# EAGLE schematic csa_blitter-v2.1a (EAGLE 4.15)
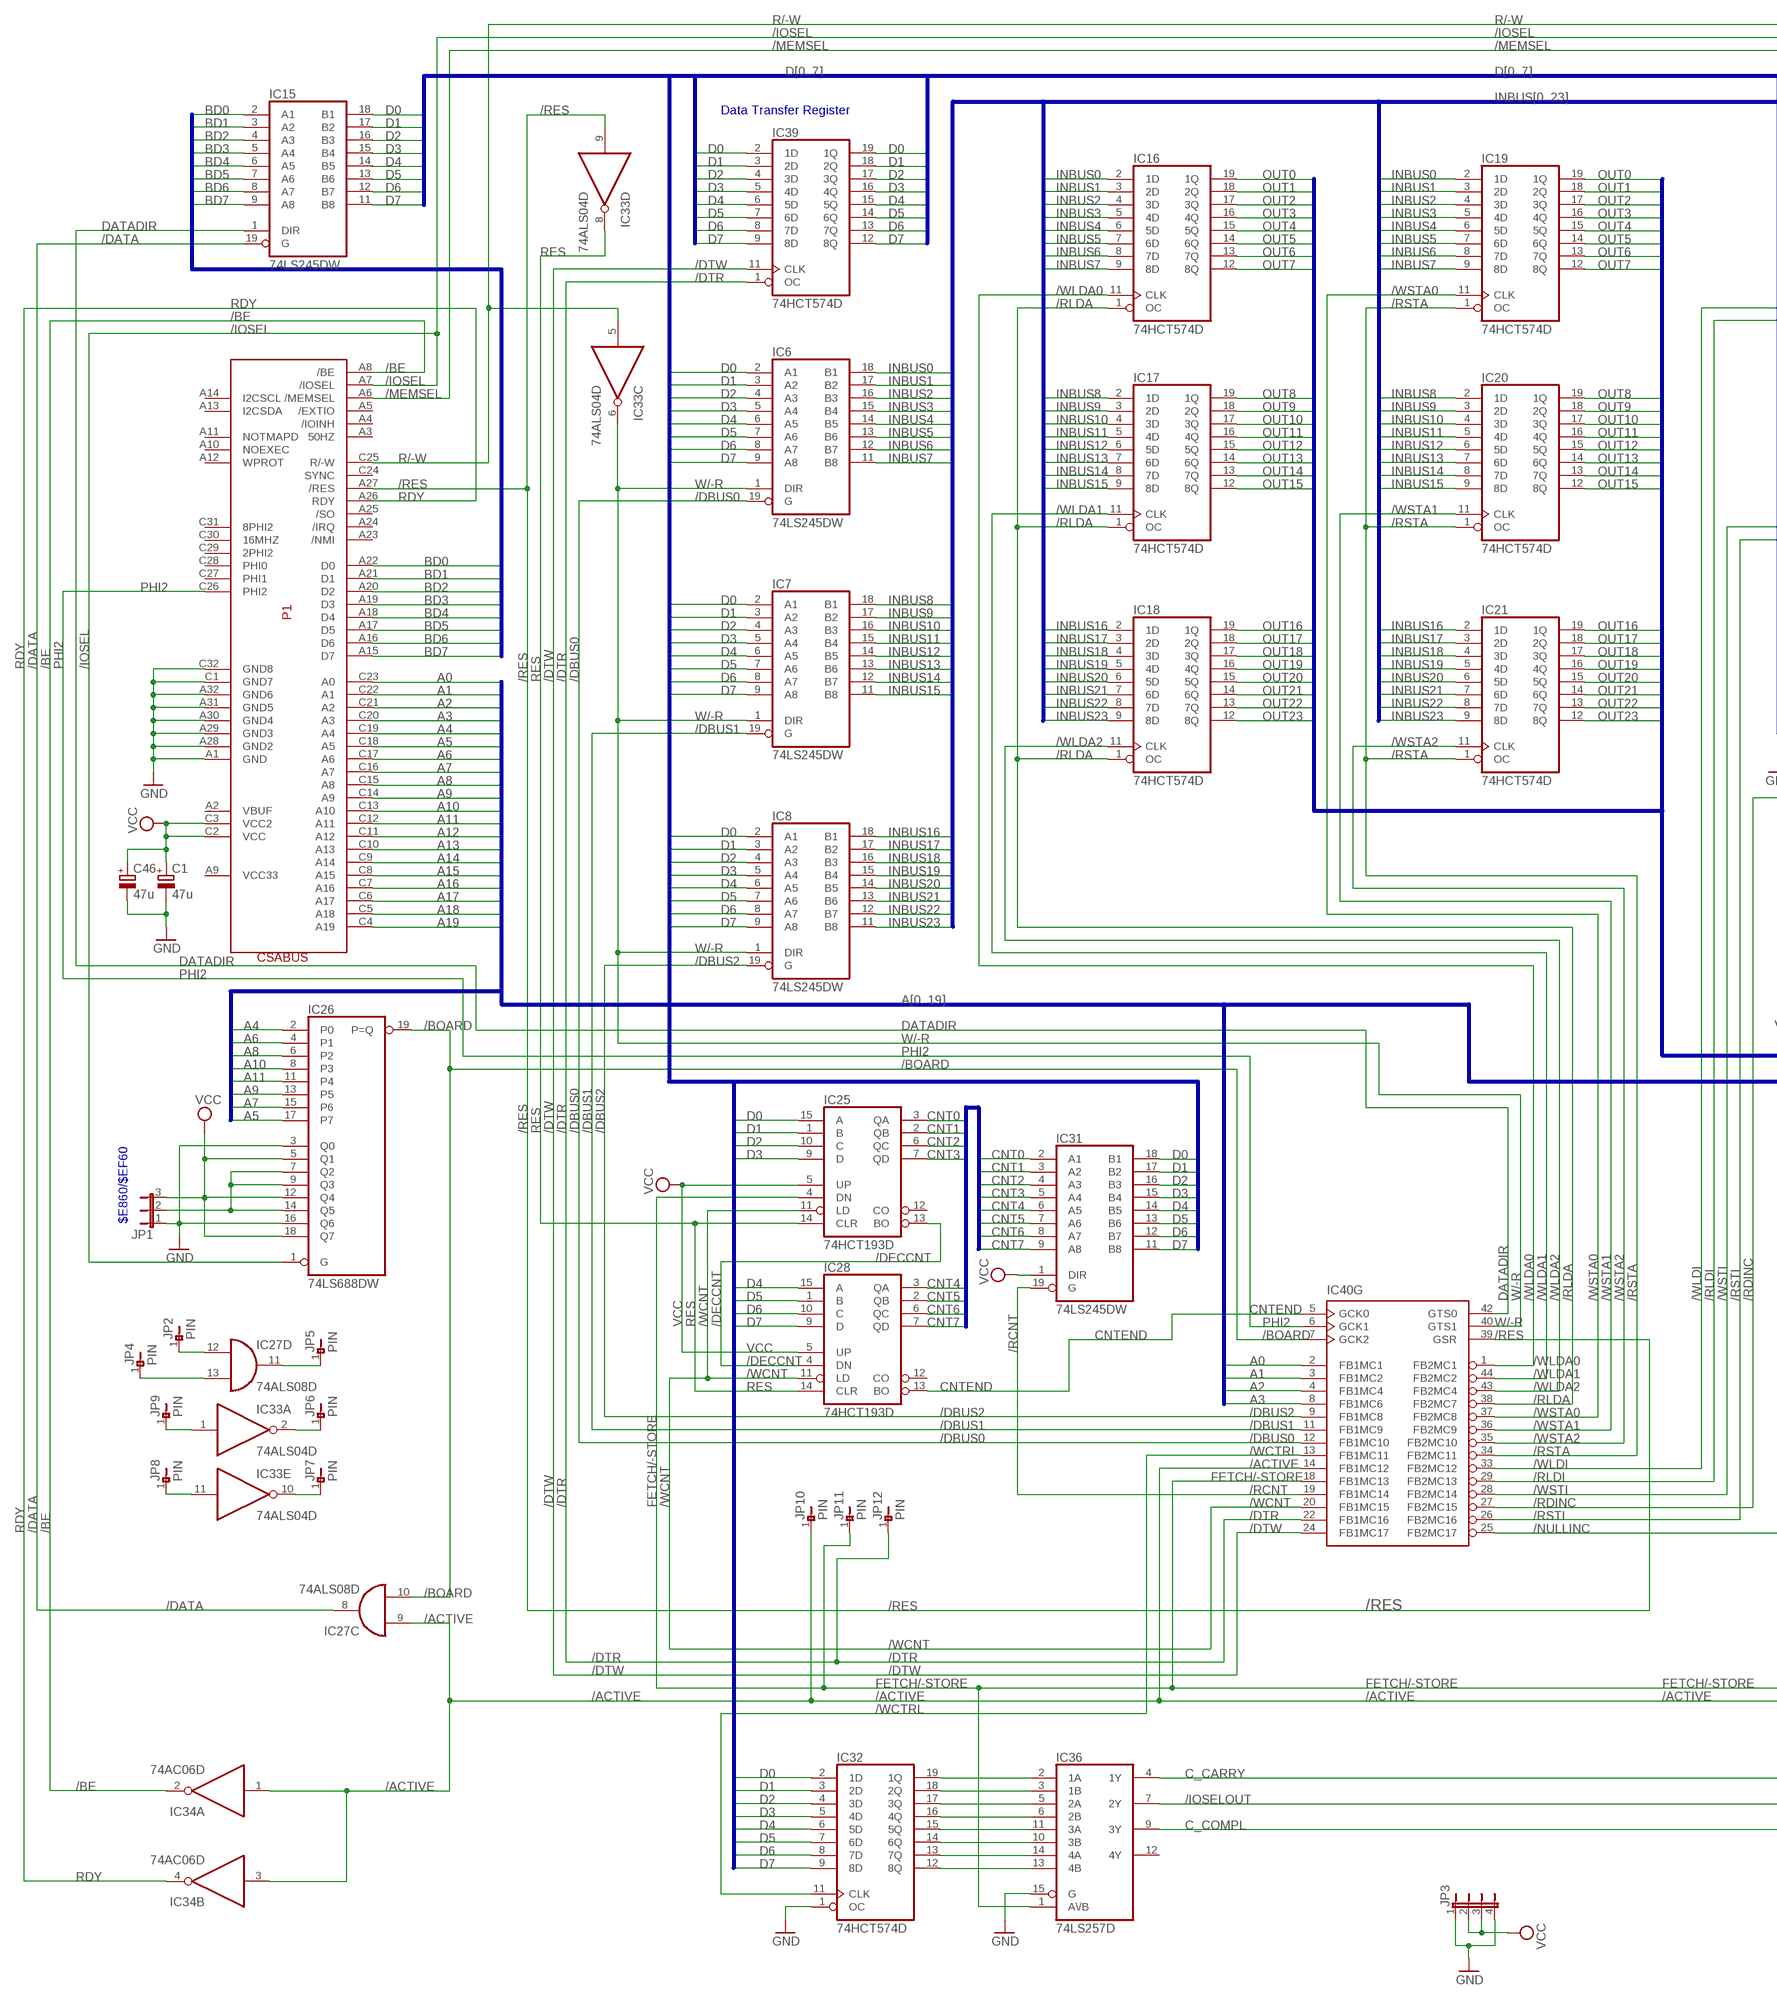
[diagram p0: schematic, sheet 1, part 1 of 2]
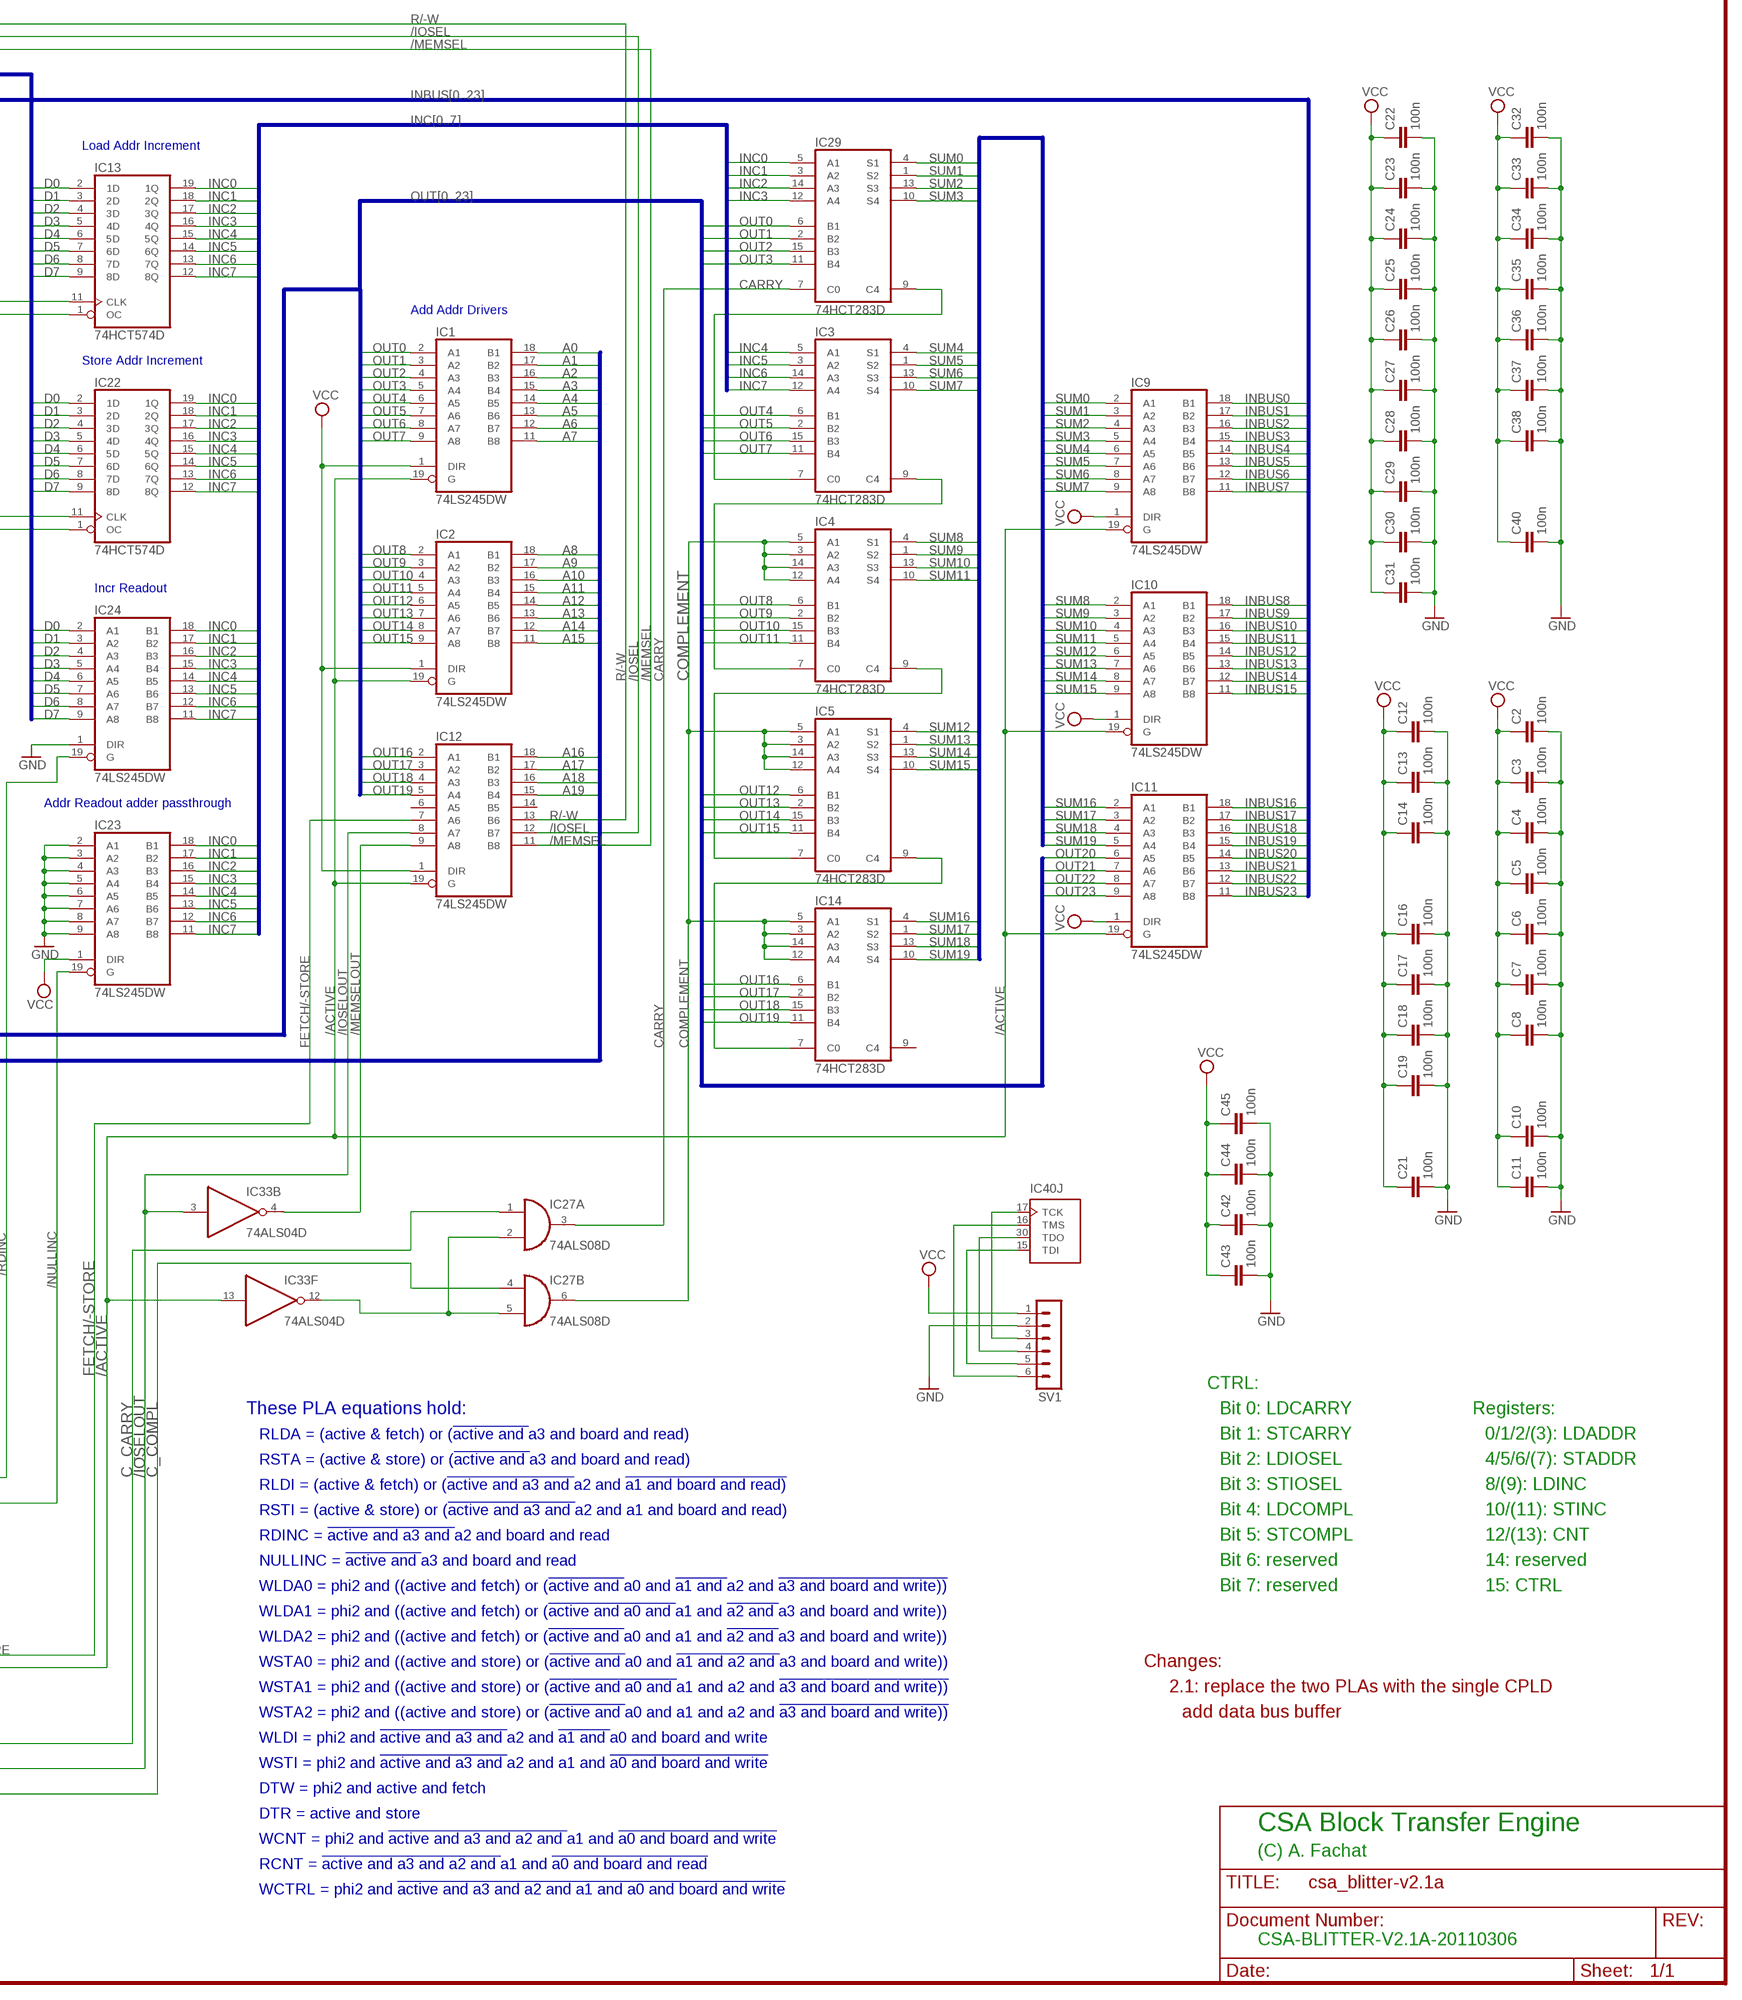
[diagram p1: schematic, sheet 1, part 2 of 2]

## Parts
C1  47u  CPOL-EUE2.5-7  [E2,5-7]
C2  100n  C-EUC1206  [C1206]
C3  100n  C-EUC1206  [C1206]
C4  100n  C-EUC1206  [C1206]
C5  100n  C-EUC1206  [C1206]
C6  100n  C-EUC1206  [C1206]
C7  100n  C-EUC1206  [C1206]
C8  100n  C-EUC1206  [C1206]
C10  100n  C-EUC1206  [C1206]
C11  100n  C-EUC1206  [C1206]
C12  100n  C-EUC1206  [C1206]
C13  100n  C-EUC1206  [C1206]
C14  100n  C-EUC1206  [C1206]
C16  100n  C-EU025-025X050  [C025-025X050]
C17  100n  C-EUC1206  [C1206]
C18  100n  C-EUC1206  [C1206]
C19  100n  C-EUC1206  [C1206]
C21  100n  C-EUC1206  [C1206]
C22  100n  C-EUC1206  [C1206]
C23  100n  C-EUC1206  [C1206]
C24  100n  C-EUC1206  [C1206]
C25  100n  C-EUC1206  [C1206]
C26  100n  C-EUC1206  [C1206]
C27  100n  C-EUC1206  [C1206]
C28  100n  C-EUC1206  [C1206]
C29  100n  C-EUC1206  [C1206]
C30  100n  C-EUC1206  [C1206]
C31  100n  C-EUC1206  [C1206]
C32  100n  C-EUC1206  [C1206]
C33  100n  C-EUC1206  [C1206]
C34  100n  C-EUC1206  [C1206]
C35  100n  C-EU025-025X050  [C025-025X050]
C36  100n  C-EU025-025X050  [C025-025X050]
C37  100n  C-EUC1206  [C1206]
C38  100n  C-EUC1206  [C1206]
C40  100n  C-EUC1206  [C1206]
C42  100n  C-EUC1206  [C1206]
C43  100n  C-EUC1206  [C1206]
C44  100n  C-EU025-025X050  [C025-025X050]
C45  100n  C-EUC1206  [C1206]
C46  47u  CPOL-EUE2.5-7  [E2,5-7]
IC1  74LS245DW  [SO20W]
IC2  74LS245DW  [SO20W]
IC3  74HCT283D  [SO16]
IC4  74HCT283D  [SO16]
IC5  74HCT283D  [SO16]
IC6  74LS245DW  [SO20W]
IC7  74LS245DW  [SO20W]
IC8  74LS245DW  [SO20W]
IC9  74LS245DW  [SO20W]
IC10  74LS245DW  [SO20W]
IC11  74LS245DW  [SO20W]
IC12  74LS245DW  [SO20W]
IC13  74HCT574D  [SO20W]
IC14  74HCT283D  [SO16]
IC15  74LS245DW  [SO20W]
IC16  74HCT574D  [SO20W]
IC17  74HCT574D  [SO20W]
IC18  74HCT574D  [SO20W]
IC19  74HCT574D  [SO20W]
IC20  74HCT574D  [SO20W]
IC21  74HCT574D  [SO20W]
IC22  74HCT574D  [SO20W]
IC23  74LS245DW  [SO20W]
IC24  74LS245DW  [SO20W]
IC25  74HCT193D  74HCT192D  [SO16]
IC26  74LS688DW  [SO20W]
IC27  74ALS08D  [SO14]
IC28  74HCT193D  74HCT192D  [SO16]
IC29  74HCT283D  [SO16]
IC31  74LS245DW  [SO20W]
IC32  74HCT574D  [SO20W]
IC33  74ALS04D  [SO14]
IC34  74AC06D  [SO14]
IC36  74LS257D  [SO16]
IC39  74HCT574D  [SO20W]
IC40  XC9536-44  [PLCC-S44]
JP1  JP2E  [JP2]
JP2  PIN  [PIN]
JP3  JP4E  [JP4]
JP4  PIN  [PIN]
JP5  PIN  [PIN]
JP6  PIN  [PIN]
JP7  PIN  [PIN]
JP8  PIN  [PIN]
JP9  PIN  [PIN]
JP10  PIN  [PIN]
JP11  PIN  [PIN]
JP12  PIN  [PIN]
P1  CSABUS  [CSABUS]
SV1  MA06-1  [MA06-1]

## Nets
/ACTIVE: IC1.19(G) IC2.19(G) IC9.19(G) IC10.19(G) IC11.19(G) IC12.19(G) IC27.9(C:I0) IC33.13(F:I) IC34.1(A:I) IC34.3(B:I) IC40.14(G:FB1MC12) JP10.1
/BE: IC34.2(A:O) P1.A8(/BE)
/BOARD: IC26.19(P=Q) IC27.10(C:I1) IC40.7(G:GCK2)
/DATA: IC15.19(G) IC27.8(C:O)
/DBUS0: IC6.19(G) IC40.12(G:FB1MC10)
/DBUS1: IC7.19(G) IC40.11(G:FB1MC9)
/DBUS2: IC8.19(G) IC40.9(G:FB1MC8)
/DECCNT: IC25.13(BO) IC28.4(DN)
/DTR: IC39.1(OC) IC40.22(G:FB1MC16) JP12.1
/DTW: IC39.11(CLK) IC40.24(G:FB1MC17)
/IOSEL: IC12.12(B7) IC26.1(G) P1.A7(/IOSEL)
/IOSELOUT: IC12.8(A7) IC33.3(B:I) IC36.7(2Y)
/MEMSEL: IC12.11(B8) P1.A6(/MEMSEL)
/MEMSELOUT: IC12.9(A8) IC33.4(B:O)
/NULLINC: IC23.19(G) IC40.25(G:FB2MC17)
/RCNT: IC31.19(G) IC40.19(G:FB1MC14)
/RDINC: IC24.19(G) IC40.27(G:FB2MC15)
/RES: IC33.9(D:I) IC40.39(G:GSR) P1.A27(/RES)
/RLDA: IC16.1(OC) IC17.1(OC) IC18.1(OC) IC40.38(G:FB2MC7)
/RLDI: IC13.1(OC) IC40.29(G:FB2MC13)
/RSTA: IC19.1(OC) IC20.1(OC) IC21.1(OC) IC40.34(G:FB2MC11)
/RSTI: IC22.1(OC) IC40.26(G:FB2MC16)
/WCNT: IC25.11(LD) IC28.11(LD) IC40.20(G:FB1MC15)
/WCTRL: IC32.11(CLK) IC40.13(G:FB1MC11)
/WLDA0: IC16.11(CLK) IC40.1(G:FB2MC1)
/WLDA1: IC17.11(CLK) IC40.44(G:FB2MC2)
/WLDA2: IC18.11(CLK) IC40.43(G:FB2MC4)
/WLDI: IC13.11(CLK) IC40.33(G:FB2MC12)
/WSTA0: IC19.11(CLK) IC40.37(G:FB2MC8)
/WSTA1: IC20.11(CLK) IC40.36(G:FB2MC9)
/WSTA2: IC21.11(CLK) IC40.35(G:FB2MC10)
/WSTI: IC22.11(CLK) IC40.28(G:FB2MC14)
A0: IC1.18(B1) IC40.2(G:FB1MC1) P1.C23(A0)
A1: IC1.17(B2) IC40.3(G:FB1MC2) P1.C22(A1)
A2: IC1.16(B3) IC40.4(G:FB1MC4) P1.C21(A2)
A3: IC1.15(B4) IC40.8(G:FB1MC6) P1.C20(A3)
A4: IC1.14(B5) IC26.2(P0) P1.C19(A4)
A5: IC1.13(B6) IC26.17(P7) P1.C18(A5)
A6: IC1.12(B7) IC26.4(P1) P1.C17(A6)
A7: IC1.11(B8) IC26.15(P6) P1.C16(A7)
A8: IC2.18(B1) IC26.6(P2) P1.C15(A8)
A9: IC2.17(B2) IC26.13(P5) P1.C14(A9)
A10: IC2.16(B3) IC26.8(P3) P1.C13(A10)
A11: IC2.15(B4) IC26.11(P4) P1.C12(A11)
A12: IC2.14(B5) P1.C11(A12)
A13: IC2.13(B6) P1.C10(A13)
A14: IC2.12(B7) P1.C9(A14)
A15: IC2.11(B8) P1.C8(A15)
A16: IC12.18(B1) P1.C7(A16)
A17: IC12.17(B2) P1.C6(A17)
A18: IC12.16(B3) P1.C5(A18)
A19: IC12.15(B4) P1.C4(A19)
BD0: IC15.2(A1) P1.A22(D0)
BD1: IC15.3(A2) P1.A21(D1)
BD2: IC15.4(A3) P1.A20(D2)
BD3: IC15.5(A4) P1.A19(D3)
BD4: IC15.6(A5) P1.A18(D4)
BD5: IC15.7(A6) P1.A17(D5)
BD6: IC15.8(A7) P1.A16(D6)
BD7: IC15.9(A8) P1.A15(D7)
C_CARRY: IC27.1(A:I0) IC36.4(1Y)
C_COMPL: IC27.4(B:I0) IC36.9(3Y)
CARRY: IC27.3(A:O) IC29.7(C0)
CNT0: IC25.3(QA) IC31.2(A1)
CNT1: IC25.2(QB) IC31.3(A2)
CNT2: IC25.6(QC) IC31.4(A3)
CNT3: IC25.7(QD) IC31.5(A4)
CNT4: IC28.3(QA) IC31.6(A5)
CNT5: IC28.2(QB) IC31.7(A6)
CNT6: IC28.6(QC) IC31.8(A7)
CNT7: IC28.7(QD) IC31.9(A8)
CNTEND: IC28.13(BO) IC40.5(G:GCK0)
COMPLEMENT: IC4.3(A2) IC4.5(A1) IC4.12(A4) IC4.14(A3) IC5.3(A2) IC5.5(A1) IC5.12(A4) IC5.14(A3) IC14.3(A2) IC14.5(A1) IC14.12(A4) IC14.14(A3) IC27.6(B:O)
D0: IC6.2(A1) IC7.2(A1) IC8.2(A1) IC13.2(1D) IC15.18(B1) IC22.2(1D) IC24.2(A1) IC25.15(A) IC31.18(B1) IC32.2(1D) IC39.2(1D) IC39.19(1Q)
D1: IC6.3(A2) IC7.3(A2) IC8.3(A2) IC13.3(2D) IC15.17(B2) IC22.3(2D) IC24.3(A2) IC25.1(B) IC31.17(B2) IC32.3(2D) IC39.3(2D) IC39.18(2Q)
D2: IC6.4(A3) IC7.4(A3) IC8.4(A3) IC13.4(3D) IC15.16(B3) IC22.4(3D) IC24.4(A3) IC25.10(C) IC31.16(B3) IC32.4(3D) IC39.4(3D) IC39.17(3Q)
D3: IC6.5(A4) IC7.5(A4) IC8.5(A4) IC13.5(4D) IC15.15(B4) IC22.5(4D) IC24.5(A4) IC25.9(D) IC31.15(B4) IC32.5(4D) IC39.5(4D) IC39.16(4Q)
D4: IC6.6(A5) IC7.6(A5) IC8.6(A5) IC13.6(5D) IC15.14(B5) IC22.6(5D) IC24.6(A5) IC28.15(A) IC31.14(B5) IC32.6(5D) IC39.6(5D) IC39.15(5Q)
D5: IC6.7(A6) IC7.7(A6) IC8.7(A6) IC13.7(6D) IC15.13(B6) IC22.7(6D) IC24.7(A6) IC28.1(B) IC31.13(B6) IC32.7(6D) IC39.7(6D) IC39.14(6Q)
D6: IC6.8(A7) IC7.8(A7) IC8.8(A7) IC13.8(7D) IC15.12(B7) IC22.8(7D) IC24.8(A7) IC28.10(C) IC31.12(B7) IC32.8(7D) IC39.8(7D) IC39.13(7Q)
D7: IC6.9(A8) IC7.9(A8) IC8.9(A8) IC13.9(8D) IC15.11(B8) IC22.9(8D) IC24.9(A8) IC28.9(D) IC31.11(B8) IC32.9(8D) IC39.9(8D) IC39.12(8Q)
DATADIR: IC15.1(DIR) IC40.42(G:GTS0)
FETCH/-STORE: IC12.7(A6) IC25.4(DN) IC36.1(A\/B) IC40.18(G:FB1MC13) JP11.1
GND: C1.- C2.2 C3.2 C4.2 C5.2 C6.2 C7.2 C8.2 C10.2 C11.2 C12.2 C13.2 C14.2 C16.2 C17.2 C18.2 C19.2 C21.2 C22.2 C23.2 C24.2 C25.2 C26.2 C27.2 C28.2 C29.2 C30.2 C31.2 C32.2 C33.2 C34.2 C35.2 C36.2 C37.2 C38.2 C40.2 C42.2 C43.2 C44.2 C45.2 C46.- IC23.2(A1) IC23.3(A2) IC23.4(A3) IC23.5(A4) IC23.6(A5) IC23.7(A6) IC23.8(A7) IC23.9(A8) IC24.1(DIR) IC26.3(Q0) IC26.16(Q6) IC32.1(OC) IC36.15(G) JP1.1 JP3.1 JP3.4 P1.A1(GND) P1.A28(GND2) P1.A29(GND3) P1.A30(GND4) P1.A31(GND5) P1.A32(GND6) P1.C1(GND7) P1.C32(GND8) SV1.2
INBUS0: IC6.18(B1) IC9.18(B1) IC16.2(1D) IC19.2(1D)
INBUS1: IC6.17(B2) IC9.17(B2) IC16.3(2D) IC19.3(2D)
INBUS2: IC6.16(B3) IC9.16(B3) IC16.4(3D) IC19.4(3D)
INBUS3: IC6.15(B4) IC9.15(B4) IC16.5(4D) IC19.5(4D)
INBUS4: IC6.14(B5) IC9.14(B5) IC16.6(5D) IC19.6(5D)
INBUS5: IC6.13(B6) IC9.13(B6) IC16.7(6D) IC19.7(6D)
INBUS6: IC6.12(B7) IC9.12(B7) IC16.8(7D) IC19.8(7D)
INBUS7: IC6.11(B8) IC9.11(B8) IC16.9(8D) IC19.9(8D)
INBUS8: IC7.18(B1) IC10.18(B1) IC17.2(1D) IC20.2(1D)
INBUS9: IC7.17(B2) IC10.17(B2) IC17.3(2D) IC20.3(2D)
INBUS10: IC7.16(B3) IC10.16(B3) IC17.4(3D) IC20.4(3D)
INBUS11: IC7.15(B4) IC10.15(B4) IC17.5(4D) IC20.5(4D)
INBUS12: IC7.14(B5) IC10.14(B5) IC17.6(5D) IC20.6(5D)
INBUS13: IC7.13(B6) IC10.13(B6) IC17.7(6D) IC20.7(6D)
INBUS14: IC7.12(B7) IC10.12(B7) IC17.8(7D) IC20.8(7D)
INBUS15: IC7.11(B8) IC10.11(B8) IC17.9(8D) IC20.9(8D)
INBUS16: IC8.18(B1) IC11.18(B1) IC18.2(1D) IC21.2(1D)
INBUS17: IC8.17(B2) IC11.17(B2) IC18.3(2D) IC21.3(2D)
INBUS18: IC8.16(B3) IC11.16(B3) IC18.4(3D) IC21.4(3D)
INBUS19: IC8.15(B4) IC11.15(B4) IC18.5(4D) IC21.5(4D)
INBUS20: IC8.14(B5) IC11.14(B5) IC18.6(5D) IC21.6(5D)
INBUS21: IC8.13(B6) IC11.13(B6) IC18.7(6D) IC21.7(6D)
INBUS22: IC8.12(B7) IC11.12(B7) IC18.8(7D) IC21.8(7D)
INBUS23: IC8.11(B8) IC11.11(B8) IC18.9(8D) IC21.9(8D)
INC0: IC13.19(1Q) IC22.19(1Q) IC23.18(B1) IC24.18(B1) IC29.5(A1)
INC1: IC13.18(2Q) IC22.18(2Q) IC23.17(B2) IC24.17(B2) IC29.3(A2)
INC2: IC13.17(3Q) IC22.17(3Q) IC23.16(B3) IC24.16(B3) IC29.14(A3)
INC3: IC13.16(4Q) IC22.16(4Q) IC23.15(B4) IC24.15(B4) IC29.12(A4)
INC4: IC3.5(A1) IC13.15(5Q) IC22.15(5Q) IC23.14(B5) IC24.14(B5)
INC5: IC3.3(A2) IC13.14(6Q) IC22.14(6Q) IC23.13(B6) IC24.13(B6)
INC6: IC3.14(A3) IC13.13(7Q) IC22.13(7Q) IC23.12(B7) IC24.12(B7)
INC7: IC3.12(A4) IC13.12(8Q) IC22.12(8Q) IC23.11(B8) IC24.11(B8)
N$1: IC3.7(C0) IC29.9(C4)
N$2: IC3.9(C4) IC4.7(C0)
N$3: IC4.9(C4) IC5.7(C0)
N$4: IC5.9(C4) IC14.7(C0)
N$5: IC26.7(Q2) IC26.9(Q3) IC26.14(Q5) JP1.2
N$6: IC32.19(1Q) IC36.2(1A)
N$7: IC27.12(D:I0) JP2.1
N$8: IC32.18(2Q) IC36.3(1B)
N$9: IC27.13(D:I1) JP4.1
N$10: IC32.17(3Q) IC36.5(2A)
N$11: IC32.16(4Q) IC36.6(2B)
N$12: IC32.15(5Q) IC36.11(3A)
N$13: IC32.14(6Q) IC36.10(3B)
N$14: IC32.13(7Q) IC36.14(4A)
N$15: IC32.12(8Q) IC36.13(4B)
N$16: IC27.11(D:O) JP5.1
N$17: IC33.2(A:O) JP6.1
N$18: IC33.10(E:O) JP7.1
N$19: IC33.11(E:I) JP8.1
N$20: IC33.1(A:I) JP9.1
N$21: IC27.2(A:I1) IC27.5(B:I1) IC33.12(F:O)
OUT0: IC1.2(A1) IC16.19(1Q) IC19.19(1Q) IC29.6(B1)
OUT1: IC1.3(A2) IC16.18(2Q) IC19.18(2Q) IC29.2(B2)
OUT2: IC1.4(A3) IC16.17(3Q) IC19.17(3Q) IC29.15(B3)
OUT3: IC1.5(A4) IC16.16(4Q) IC19.16(4Q) IC29.11(B4)
OUT4: IC1.6(A5) IC3.6(B1) IC16.15(5Q) IC19.15(5Q)
OUT5: IC1.7(A6) IC3.2(B2) IC16.14(6Q) IC19.14(6Q)
OUT6: IC1.8(A7) IC3.15(B3) IC16.13(7Q) IC19.13(7Q)
OUT7: IC1.9(A8) IC3.11(B4) IC16.12(8Q) IC19.12(8Q)
OUT8: IC2.2(A1) IC4.6(B1) IC17.19(1Q) IC20.19(1Q)
OUT9: IC2.3(A2) IC4.2(B2) IC17.18(2Q) IC20.18(2Q)
OUT10: IC2.4(A3) IC4.15(B3) IC17.17(3Q) IC20.17(3Q)
OUT11: IC2.5(A4) IC4.11(B4) IC17.16(4Q) IC20.16(4Q)
OUT12: IC2.6(A5) IC5.6(B1) IC17.15(5Q) IC20.15(5Q)
OUT13: IC2.7(A6) IC5.2(B2) IC17.14(6Q) IC20.14(6Q)
OUT14: IC2.8(A7) IC5.15(B3) IC17.13(7Q) IC20.13(7Q)
OUT15: IC2.9(A8) IC5.11(B4) IC17.12(8Q) IC20.12(8Q)
OUT16: IC12.2(A1) IC14.6(B1) IC18.19(1Q) IC21.19(1Q)
OUT17: IC12.3(A2) IC14.2(B2) IC18.18(2Q) IC21.18(2Q)
OUT18: IC12.4(A3) IC14.15(B3) IC18.17(3Q) IC21.17(3Q)
OUT19: IC12.5(A4) IC14.11(B4) IC18.16(4Q) IC21.16(4Q)
OUT20: IC11.6(A5) IC18.15(5Q) IC21.15(5Q)
OUT21: IC11.7(A6) IC18.14(6Q) IC21.14(6Q)
OUT22: IC11.8(A7) IC18.13(7Q) IC21.13(7Q)
OUT23: IC11.9(A8) IC18.12(8Q) IC21.12(8Q)
PHI2: IC40.6(G:GCK1) P1.C26(PHI2)
R/-W: IC12.13(B6) IC33.5(C:I) P1.C25(R/-W)
RDY: IC34.4(B:O) P1.A26(RDY)
RES: IC25.14(CLR) IC28.14(CLR) IC33.8(D:O)
SUM0: IC9.2(A1) IC29.4(S1)
SUM1: IC9.3(A2) IC29.1(S2)
SUM2: IC9.4(A3) IC29.13(S3)
SUM3: IC9.5(A4) IC29.10(S4)
SUM4: IC3.4(S1) IC9.6(A5)
SUM5: IC3.1(S2) IC9.7(A6)
SUM6: IC3.13(S3) IC9.8(A7)
SUM7: IC3.10(S4) IC9.9(A8)
SUM8: IC4.4(S1) IC10.2(A1)
SUM9: IC4.1(S2) IC10.3(A2)
SUM10: IC4.13(S3) IC10.4(A3)
SUM11: IC4.10(S4) IC10.5(A4)
SUM12: IC5.4(S1) IC10.6(A5)
SUM13: IC5.1(S2) IC10.7(A6)
SUM14: IC5.13(S3) IC10.8(A7)
SUM15: IC5.10(S4) IC10.9(A8)
SUM16: IC11.2(A1) IC14.4(S1)
SUM17: IC11.3(A2) IC14.1(S2)
SUM18: IC11.4(A3) IC14.13(S3)
SUM19: IC11.5(A4) IC14.10(S4)
TCK: IC40.17(J:TCK) SV1.3
TDI: IC40.15(J:TDI) SV1.5
TDO: IC40.30(J:TDO) SV1.4
TMS: IC40.16(J:TMS) SV1.6
VCC: C1.+ C2.1 C3.1 C4.1 C5.1 C6.1 C7.1 C8.1 C10.1 C11.1 C12.1 C13.1 C14.1 C16.1 C17.1 C18.1 C19.1 C21.1 C22.1 C23.1 C24.1 C25.1 C26.1 C27.1 C28.1 C29.1 C30.1 C31.1 C32.1 C33.1 C34.1 C35.1 C36.1 C37.1 C38.1 C40.1 C42.1 C43.1 C44.1 C45.1 C46.+ IC1.1(DIR) IC2.1(DIR) IC9.1(DIR) IC10.1(DIR) IC11.1(DIR) IC12.1(DIR) IC23.1(DIR) IC25.5(UP) IC26.5(Q1) IC26.12(Q4) IC26.18(Q7) IC28.5(UP) IC31.1(DIR) JP1.3 JP3.2 JP3.3 P1.C2(VCC) P1.C3(VCC2) SV1.1
W/-R: IC6.1(DIR) IC7.1(DIR) IC8.1(DIR) IC33.6(C:O) IC40.40(G:GTS1)
Unconnected: IC12.6(A5) IC12.14(B5) IC14.9(C4) IC25.12(CO) IC28.12(CO) IC34.5(C:I) IC34.6(C:O) IC34.8(D:O) IC34.9(D:I) IC34.10(E:O) IC34.11(E:I) IC34.12(F:O) IC34.13(F:I) IC36.12(4Y) P1.A2(VBUF) P1.A3(50HZ) P1.A4(/IOINH) P1.A5(/EXTIO) P1.A9(VCC33) P1.A10(NOEXEC) P1.A11(NOTMAPD) P1.A12(WPROT) P1.A13(I2CSDA) P1.A14(I2CSCL) P1.A23(/NMI) P1.A24(/IRQ) P1.A25(/SO) P1.C24(SYNC) P1.C27(PHI1) P1.C28(PHI0) P1.C29(2PHI2) P1.C30(16MHZ) P1.C31(8PHI2)

## Buses
D[0..7]
OUT[0..23]
A[0..19]
INC[0..7]
SUM[0..19]
CNT[0..7]
INBUS[0..23]
BD[0..7]

## Notes on the sheet
- Data Transfer Register
- Load Addr Increment
- Add Addr Drivers
- Store Addr Increment
- Incr Readout
- Addr Readout adder passthrough
- $E860/$EF60
- CTRL:
- These PLA equations hold: | Bit 0: LDCARRY | Registers:
- RLDA = (active & fetch) or (!active and !a3 and board and read) | Bit 1: STCARRY | 0/1/2/(3): LDADDR
- RSTA = (active & store) or (!active and !a3 and board and read) | Bit 2: LDIOSEL | 4/5/6/(7): STADDR
- RLDI = (active & fetch) or (!active and a3 and !a2 and !a1 and board and read) | Bit 3: STIOSEL | 8/(9): LDINC
- RSTI = (active & store) or (!active and a3 and !a2 and a1 and board and read) | Bit 4: LDCOMPL | 10/(11): STINC
- RDINC = !active and a3 and !a2 and board and read | Bit 5: STCOMPL | 12/(13): CNT
- NULLINC = !active and !a3 and board and read | Bit 6: reserved | 14: reserved
- WLDA0 = phi2 and ((active and fetch) or (!active and !a0 and !a1 and !a2 and !a3 and board and write)) | Bit 7: reserved | 15: CTRL
- WLDA1 = phi2 and ((active and fetch) or (!active and a0 and !a1 and !a2 and !a3 and board and write))
- WLDA2 = phi2 and ((active and fetch) or (!active and !a0 and a1 and !a2 and !a3 and board and write))
- WSTA0 = phi2 and ((active and store) or (!active and !a0 and !a1 and a2 and !a3 and board and write)) | Changes:
- WSTA1 = phi2 and ((active and store) or (!active and a0 and !a1 and a2 and !a3 and board and write)) | 2.1: replace the two PLAs with the single CPLD
- WSTA2 = phi2 and ((active and store) or (!active and !a0 and a1 and a2 and !a3 and board and write)) | add data bus buffer
- WLDI = phi2 and !active and a3 and !a2 and !a1 and !a0 and board and write
- WSTI = phi2 and !active and a3 and !a2 and a1 and !a0 and board and write
- DTW = phi2 and active and fetch
- DTR = active and store
- CSA Block Transfer Engine
- WCNT = phi2 and !active and a3 and a2 and !a1 and !a0 and board and write
- (C) A. Fachat
- RCNT = !active and a3 and a2 and !a1 and !a0 and board and read
- WCTRL = phi2 and !active and a3 and a2 and a1 and a0 and board and write
- CSA-BLITTER-V2.1A-20110306

## Power pins joined to a net without a drawn wire
GND: IC1.10(GND) IC2.10(GND) IC3.8(GND) IC4.8(GND) IC5.8(GND) IC6.10(GND) IC7.10(GND) IC8.10(GND) IC9.10(GND) IC10.10(GND) IC11.10(GND) IC12.10(GND) IC13.10(GND) IC14.8(GND) IC15.10(GND) IC16.10(GND) IC17.10(GND) IC18.10(GND) IC19.10(GND) IC20.10(GND) IC21.10(GND) IC22.10(GND) IC23.10(GND) IC24.10(GND) IC25.8(GND) IC26.10(GND) IC27.7(P:GND) IC28.8(GND) IC29.8(GND) IC31.10(GND) IC32.10(GND) IC33.7(P:GND) IC34.7(P:GND) IC36.8(GND) IC39.10(GND) IC40.10(P:GND) IC40.23(P:GND) IC40.31(P:GND)
VCC: IC1.20(VCC) IC2.20(VCC) IC3.16(VCC) IC4.16(VCC) IC5.16(VCC) IC6.20(VCC) IC7.20(VCC) IC8.20(VCC) IC9.20(VCC) IC10.20(VCC) IC11.20(VCC) IC12.20(VCC) IC13.20(VCC) IC14.16(VCC) IC15.20(VCC) IC16.20(VCC) IC17.20(VCC) IC18.20(VCC) IC19.20(VCC) IC20.20(VCC) IC21.20(VCC) IC22.20(VCC) IC23.20(VCC) IC24.20(VCC) IC25.16(VCC) IC26.20(VCC) IC27.14(P:VCC) IC28.16(VCC) IC29.16(VCC) IC31.20(VCC) IC32.20(VCC) IC33.14(P:VCC) IC34.14(P:VCC) IC36.16(VCC) IC39.20(VCC) IC40.21(P:VCC) IC40.32(P:VCC) IC40.41(P:VCC)

## Library data of the parts
C1 C46 = rcl:CPOL-EU: POLARIZED CAPACITOR, European symbol
C2-C8 C10-C14 C16-C19 C21-C38 C40 C42-C45 = rcl:C-EU: CAPACITOR, European symbol
IC1 IC2 IC6-IC12 IC15 IC23 IC24 IC31 = 74xx-eu:74*245: Octal BUS TRANSCEIVER, 3-state
IC3-IC5 IC14 IC29 = 74xx-eu:74*283: 4-bit binary FULL ADDER, fast carry
IC13 IC16-IC22 IC32 IC39 = 74xx-eu:74*574: 8-bit D type FLIP FLOP bus driver
IC25 IC28 = 74xx-eu:74*192: Synchronous 4-bit UP/DOWN COUNTER
IC26 = 74xx-eu:74*688: 8-bit MAGNITUDE/IDENTITY COMPARATOR, totem pole
IC27 = 74xx-eu:74*08: Quad 2-input AND gate
IC33 = 74xx-eu:74*04: Hex INVERTER
IC34 = 74xx-eu:74*06: Hex INVERTER, open collector high-voltage output
IC36 = 74xx-eu:74*257: Quadruple 2-to 1 line data SELECTOR/MULTIPLEXER
IC40 = XILINX:XC9536-44
JP1 = jumper:JP2E: JUMPER
JP2 JP4-JP12 = csa:PIN
JP3 = jumper:JP4E: JUMPER
P1 = csa:CSABUS
SV1 = con-lstb:MA06-1: PIN HEADER